# Altium schematic sheet MCU.SchDoc
size A4; SheetNumber: 1; SheetTotal: 4
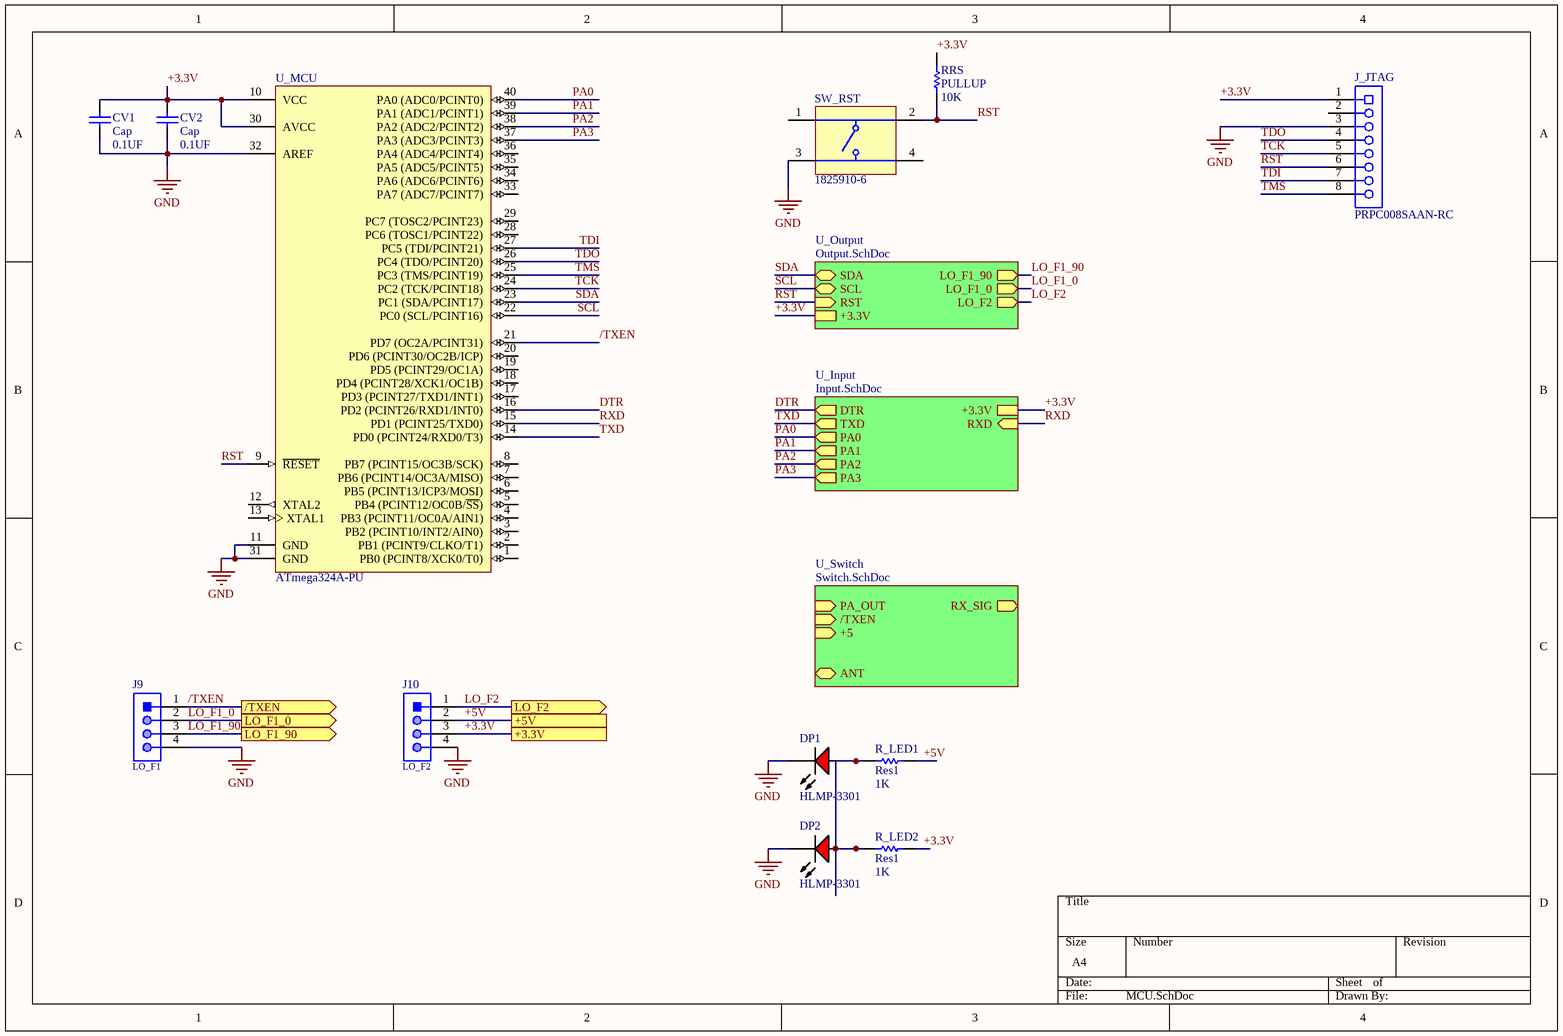
[diagram p0: MCU.SchDoc]

## Parts
CV1  Cap  value 0.1UF  [1206]
CV2  Cap  value 0.1UF  [1206]
DP1  HLMP-3301  [AVAG-HLMP-3301-2]
DP2  HLMP-3301  [AVAG-HLMP-3301-2]
J9  LO_F1  [61300411121]
J10  LO_F2  [61300411121]
J_JTAG  PRPC008SAAN-RC  [SLIN-PPPC081LFBN-RC_V]
R_LED1  Res1  value 1K  [AXIAL-0.1-RES]
R_LED2  Res1  value 1K  [AXIAL-0.1-RES]
RRS  PULLUP  value 10K  [AXIAL-0.1-RES]
SW_RST  1825910-6  [TECO-1825910-6_V]
U_MCU  ATmega324A-PU  [40P6]

## Sub-sheets
U_Input = Input.SchDoc: +3.3V, DTR (out), RXD (in), TXD (out), PA0 (out), PA1 (out), PA2 (out), PA3 (out)
U_Output = Output.SchDoc: SDA (bidir), SCL (bidir), RST (in), LO_F1_90 (out), LO_F1_0 (out), LO_F2 (out), +3.3V
U_Switch = Switch.SchDoc: PA_OUT (in), ANT (bidir), /TXEN (in), +5 (in), RX_SIG (out)

## Ports
+3.3V, +5V, /TXEN (out), LO_F1_0 (out), LO_F1_90 (out), LO_F2 (out)

## Nets
GND: CV1.1 CV2.1 DP1.1(K) DP2.1(K) J9.4 J10.4 J_JTAG.3 SW_RST.3 U_MCU.11(GND) U_MCU.31(GND) U_MCU.32(AREF)
+3.3V: CV1.2 CV2.2 J10.3 J_JTAG.1 R_LED2.2 RRS.2 U_MCU.10(VCC) U_MCU.30(AVCC) ; port +3.3V, sheet U_Output/+3.3V, sheet U_Input/+3.3V
+5V: J10.2 R_LED1.2 ; port +5V
/TXEN: J9.1 U_MCU.21(PD7_(OC2A/PCINT31)) ; port /TXEN
DTR: U_MCU.16(PD2_(PCINT26/RXD1/INT0)) ; sheet U_Input/DTR
LO_F1_0: J9.2 ; port LO_F1_0, sheet U_Output/LO_F1_0
LO_F1_90: J9.3 ; port LO_F1_90, sheet U_Output/LO_F1_90
LO_F2: J10.1 ; port LO_F2, sheet U_Output/LO_F2
PA0: U_MCU.40(PA0_(ADC0/PCINT0)) ; sheet U_Input/PA0
PA1: U_MCU.39(PA1_(ADC1/PCINT1)) ; sheet U_Input/PA1
PA2: U_MCU.38(PA2_(ADC2/PCINT2)) ; sheet U_Input/PA2
PA3: U_MCU.37(PA3_(ADC3/PCINT3)) ; sheet U_Input/PA3
RST: J_JTAG.6 RRS.1 SW_RST.2 U_MCU.9(~{RESET}) ; sheet U_Output/RST
RXD: U_MCU.15(PD1_(PCINT25/TXD0)) ; sheet U_Input/RXD
SCL: U_MCU.22(PC0_(SCL/PCINT16)) ; sheet U_Output/SCL
SDA: U_MCU.23(PC1_(SDA/PCINT17)) ; sheet U_Output/SDA
TCK: J_JTAG.5 U_MCU.24(PC2_(TCK/PCINT18))
TDI: J_JTAG.7 U_MCU.27(PC5_(TDI/PCINT21))
TDO: J_JTAG.4 U_MCU.26(PC4_(TDO/PCINT20))
TMS: J_JTAG.8 U_MCU.25(PC3_(TMS/PCINT19))
TXD: U_MCU.14(PD0_(PCINT24/RXD0/T3)) ; sheet U_Input/TXD
NetDP1_2: DP1.2(A) DP2.2(A) R_LED1.1 R_LED2.1

Not connected (* = marked no-connect by the designer): J_JTAG 2; SW_RST 1 4; U_MCU 1(PB0_(PCINT8/XCK0/T0)) 2(PB1_(PCINT9/CLKO/T1)) 3(PB2_(PCINT10/INT2/AIN0)) 4(PB3_(PCINT11/OC0A/AIN1)) 5(PB4_(PCINT12/OC0B/~{SS})) 6(PB5_(PCINT13/ICP3/MOSI)) 7(PB6_(PCINT14/OC3A/MISO)) 8(PB7_(PCINT15/OC3B/SCK)) 12(XTAL2) 13(XTAL1) 17(PD3_(PCINT27/TXD1/INT1)) 18(PD4_(PCINT28/XCK1/OC1B)) 19(PD5_(PCINT29/OC1A)) 20(PD6_(PCINT30/OC2B/ICP)) 28(PC6_(TOSC1/PCINT22)) 29(PC7_(TOSC2/PCINT23)) 33(PA7_(ADC7/PCINT7)) 34(PA6_(ADC6/PCINT6)) 35(PA5_(ADC5/PCINT5)) 36(PA4_(ADC4/PCINT4))

## Library data of the parts
CV1 CV2 = CAP CER 0.1UF 50V X7R 1206: Capacitor; Manufacturer Part Number: 885012208087; Designator: C?; Voltage Rating: 50V; Published: 8-Jun-2000; LatestRevisionDate: 17-Jul-2002; LatestRevisionNote: Re-released for DXP Platform.; Publisher: Altium Limited
DP1 DP2 = CMP-2000-06411-1: T-1 3/4 (5 mm) Diffused LED Lamp, 1.9 V, -40 to 100 degC, 2-Pin THD, RoHS, Bulk; Manufacturer: Avago; Forward Current: 25mA; Forward Voltage: 2.4V; Peak Wavelength: 635nm; Shape Type: Circular; High Brightness: No; Main Category: StandardLED; Test Current (It): 10mA; Dominant Wave Length: 626nm; Number of  Elements: 1; Reverse Voltage: 5V; Chip Material: GaP; Product Height (mm): 9.19mm; Lens Type: ColoredDiffused; Viewing Angle: 60deg; Emitting Color: Red; Luminous Intensity: 5.4mcd; Power Dissipation: 85W; DELETED: Compliant; Product Depth (mm): 6.1mm; Package Description: 2-Pin Through Hole LED, Dia 5.85 mm; Mounting Technology: ThroughHole; Manufacturer URL: http://www.avagotech.com/; Package Type: T-13/4; Operating Temp Range: -40Cto100C; Datasheet URL: http://www.avagotech.com/docs/AV02-1558EN; Mounting: ThroughHole; Lens Dimensions: 5.08x5.08x8.3mm; Package Reference: HLMP-3301; Datasheet Version: 03/2015; Pin Count: 2; Packaging: TapeandReel; Type: Uni-Color; Operating Temperature Classification: Industrial; Lum Intensity: 5.4mcd; Rad Hardened: No; Product Length (mm): 6.1mm
J9 J10 = CMP-1502-01064-1: THT Vertical Pin Header WR-PHD, Pitch 2.54 mm, Single Row, 4 pins; Manufacturer: Wurth Elektronik; Withstanding Voltage: 500VAC; Rated Current: 3A; Working Voltage: 250VAC; Pin Number: 4; Gender: Male; Contact Resistance: 20mOhm; Pitch: 2.54mm; Manufacturer URL: http://www.we-online.de; Operating Temperature: -40to105degC; Packaging: Bag; Mounting Technology: THT; Package Reference: 61300411121; Datasheet URL: https://katalog.we-online.de/em/datasheet/6130xx11121.pdf; Publisher: WurthElektronik; Part Number: 61300411121; Row Number: Single; Orientation: Vertical
J_JTAG = CMP-1770-00002-1: Female Header, Pitch 2.54 mm, 1 x 8 Position, Height 8.5 mm, Tail Length 3.2 mm, -40 to 105 degC, RoHS, Bulk; Case\Package: TO-252-3; Rds On Max: 115 mohm; Typical Rise Time: 90 ns; Max Power Dissipation: 2.5 W; Input Capacitance: 350 pF; Elements: 1; Height: 2.39 mm; Min Operating Temperature: -55 degC; RoHSCompliant: true; PackageDescription: Female Header, Pitch 2.54 mm, 1 x 8 Position, Height 8.5 mm, Tail Length 3.2 mm; Length: 6.73 mm; ComponentLink1Description: Datasheet; Package Quantity: 2500; Max Operating Temperature: 150 degC; Width: 6.22 mm; Radiation Hardening: No; Packaging: Tape and Reel; REACH SVHC: No SVHC; Pins: 3; PackageReference: PPPC081LFBN-RC; ComponentLink1URL: http://sullinscorp.com/catalogs/101_PAGE114-115_.100_FEMALE_HDR.pdf; DatasheetVersion: Jan-15; Mount: Surface Mount
R_LED1 R_LED2 = RES 1K OHM 5% 1/4W AXIAL: Resistor; Manufacturer Part Number: CFR-25JB-52-1K; Designator: R?; Power Rating: 1/4W; Tolerance: 0.05; Published: 8-Jun-2000; LatestRevisionDate: 17-Jul-2002; LatestRevisionNote: Re-released for DXP Platform.; Publisher: Altium Limited
RRS = RES 10K OHM 5% 1/4W AXIAL: Resistor; Manufacturer Part Number: CFR-25JB-52-10K; Designator: R?; Power Rating: 1/4W; Tolerance: 0.05; Published: 8-Jun-2000; LatestRevisionDate: 17-Jul-2002; LatestRevisionNote: Re-released for DXP Platform.; Publisher: Altium Limited
SW_RST = CMP-1684-00021-1: Tact Switch, SPST-NO, 0.05 A, -35 to 85 degC, 4-Pin THD, RoHS, Bulk; Manufacturer: TE Connectivity; Maximum Contact Resistance: 100mOhm; Mechanical Life: 100000Cycles; Bushing Type: Unthreaded; Switch Configuration: OFF(ON); Maximum DC Voltage Rating: 24V; Contact Rating @ Voltage: 0.05A@24VDC; Actuator Color: Black; Body Orientation: Straight; Function: MomentaryContact; Illumination: N/R; Actuator Style: RoundButton; Actuator Material: PolybutyleneTerephthalate; Dielectric Strength: 500VAC; Pole Throw Configuration: SPST; Actuator Length: 1.4mm; Product Weight: N/A; Contact Material: CopperAlloy; Housing Material: N/A; Terminal Type: PCPins; Minimum Insulation Resistance: 100MOhm; Package Description: 4-Pin Through Hole Device, Body 5.99 x 5.99 mm, Pitch 6.5 mm; Part No: 1825910-6; Package Reference: THD; Base Material: N/A; Manufacturer URL: http://www.te.com; Contact Plating: Silver; RoHS: Yes; Datasheet Version: Rev. C9; Electrical Life: 100000Cycles; Maximum AC Voltage Rating: N/A; Thread Size: N/R; Operating Temperature: -35to85C; Mounting: ThroughHole; Dimension: 5.99x5mm; Datasheet URL: http://www.te.com/commerce/DocumentDelivery/DDEController?Action=showdoc&DocId=Customer+Drawing%7F1825910%7FC9%7Fpdf%7FEnglish%7FENG_CD_1825910_C9.pdf%7F1825910-6; Family: 1825910; Seal Location: N/A; Seal Description: N/A; Packaging: N/A
U_MCU = CMP-0095-00016-2: 8-bit AVR Microcontroller, 32KB Flash, 1KB EEPROM, 2KB SRAM, 40-pin PDIP, Industrial Grade (-40°C to 85°C); ComponentLink2URL: http://www.atmel.com/dyn/resources/prod_documents/doc8272.pdf; RevisionNote: DatasheetVersion & Sch pin names updated. URLs added.; PackageReference: 40P6; PackageDescription: 40-lead (0.600"/15.24mm Wide) Plastic Dual Inline Package (PDIP); ComponentLink3Description: ATmega164A/164PA/324A/324PA/644A/644PA/1284/1284P Summary; ComponentLink3URL: http://www.atmel.com/dyn/resources/prod_documents/8272S.pdf; Code_JEDEC: MS-011-AC; ComponentLink1URL: http://www.atmel.com/; PackageVersion: revB, Sep-2001; DatasheetVersion: revC, Jun-2011; ComponentLink2Description: ATmega164A/164PA/324A/324PA/644A/644PA/1284/1284P Datasheet; ComponentLink1Description: Manufacturer URL